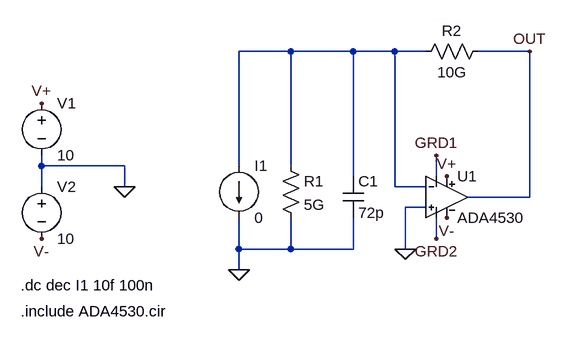
[diagram p0: schematic 003transimpedance_ada4530_one_res.asc]
003transimpedance_ada4530_one_res.asc, the LTspice schematic file:
Version 4
SHEET 1 880 680
WIRE 48 -32 -32 -32
WIRE 144 -32 48 -32
WIRE 208 -32 144 -32
WIRE 256 -32 208 -32
WIRE 416 -32 336 -32
WIRE -336 144 -336 128
WIRE -208 144 -336 144
WIRE -32 144 -32 -32
WIRE 48 144 48 -32
WIRE 144 160 144 -32
WIRE 272 160 272 128
WIRE -336 176 -336 144
WIRE -208 176 -208 144
WIRE 208 176 208 -32
WIRE 256 176 208 176
WIRE 416 192 416 -32
WIRE 416 192 320 192
WIRE 256 208 224 208
WIRE 272 256 272 224
WIRE -32 272 -32 224
WIRE 48 272 48 224
WIRE 48 272 -32 272
WIRE 144 272 144 224
WIRE 144 272 48 272
WIRE 224 272 224 208
WIRE -32 304 -32 272
FLAG -32 304 0
FLAG 224 272 0
FLAG -208 176 0
FLAG -336 48 V+
FLAG -336 256 V-
FLAG 288 224 V-
FLAG 288 160 V+
FLAG 416 -32 OUT
FLAG 272 128 GRD1
FLAG 272 256 GRD2
SYMBOL current -32 144 R0
WINDOW 123 0 0 Left 2
WINDOW 39 0 0 Left 2
SYMATTR InstName I1
SYMATTR Value 0
SYMBOL res 32 128 R0
SYMATTR InstName R1
SYMATTR Value 5G
SYMBOL cap 128 160 R0
SYMATTR InstName C1
SYMATTR Value 72p
SYMBOL res 352 -48 R90
WINDOW 0 0 56 VBottom 2
WINDOW 3 32 56 VTop 2
SYMATTR InstName R2
SYMATTR Value 10G
SYMBOL voltage -336 32 R0
WINDOW 123 0 0 Left 2
WINDOW 39 0 0 Left 2
SYMATTR InstName V1
SYMATTR Value 10
SYMBOL voltage -336 160 R0
WINDOW 123 0 0 Left 2
WINDOW 39 0 0 Left 2
SYMATTR InstName V2
SYMATTR Value 10
SYMBOL opamp_with_guards 288 128 R0
SYMATTR InstName U1
SYMATTR Value ADA4530
TEXT -368 328 Left 2 !.dc dec I1 10f 100n
TEXT -368 368 Left 2 !.include ADA4530.cir

The netlist it stands for:
* 003transimpedance_ada4530_one_res.asc
I1 N001 0 0
R1 N001 0 5G
C1 N001 0 72p
R2 OUT N001 10G
V1 V+ 0 10
V2 0 V- 10
XU1 0 N001 V+ V- OUT GRD1 GRD2 ADA4530  ; pins In+ In- V+ V- OUT GRD1 GRD2
.dc dec I1 10f 100n
.include ADA4530.cir
.backanno
.end